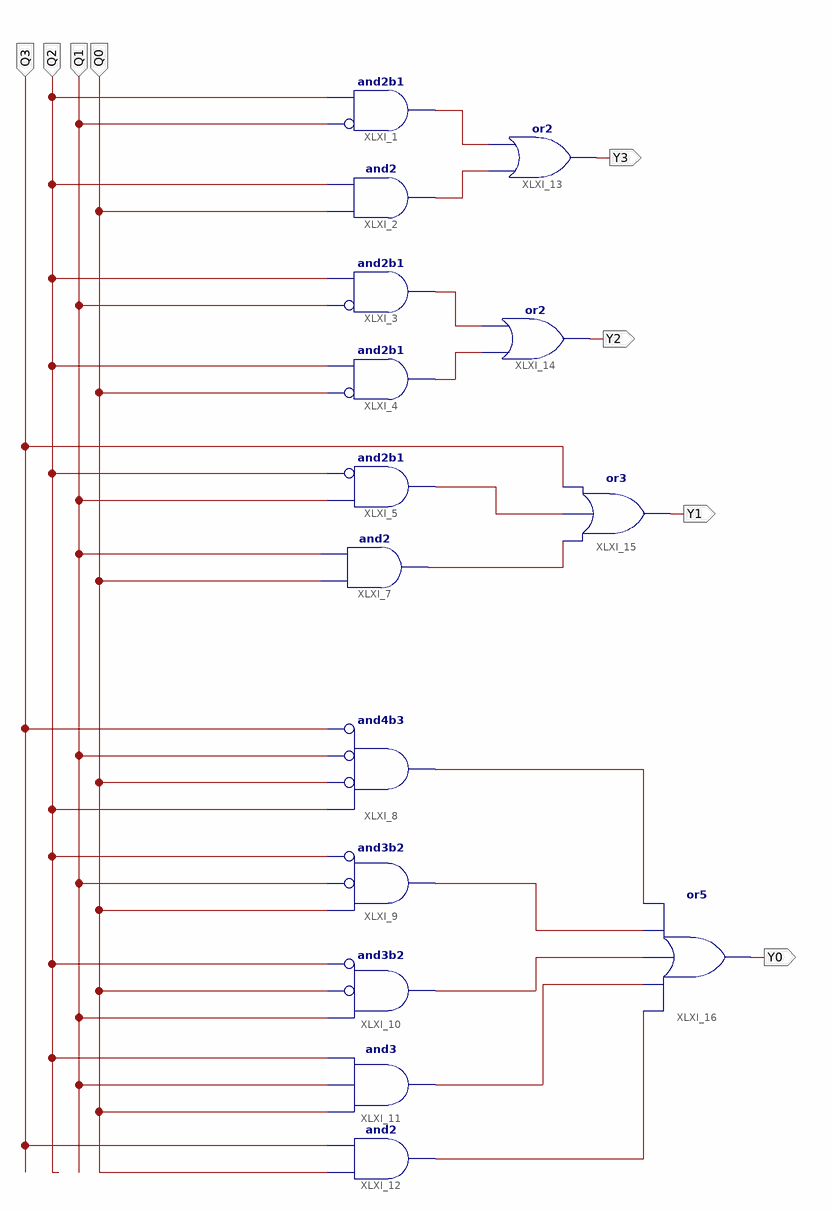
[diagram p0: schematic sheet 1]
// Xilinx ISE schematic sche3.sch (xc9500xl) as structural Verilog: 15 symbols, 8 ports
module sche3 (
  input  Q2,
  input  Q1,
  input  Q0,
  input  Q3,
  output Y3,
  output Y2,
  output Y1,
  output Y0
);

  wire XLXN_8, XLXN_9, XLXN_10, XLXN_11, XLXN_12, XLXN_13, XLXN_14, XLXN_15, XLXN_16, XLXN_17, XLXN_18;

  and XLXI_1 (XLXN_15, ~Q1, Q2);  // and2b1
  and XLXI_2 (XLXN_16, Q0, Q2);
  and XLXI_3 (XLXN_17, ~Q1, Q2);  // and2b1
  and XLXI_4 (XLXN_18, ~Q0, Q2);  // and2b1
  and XLXI_5 (XLXN_8, ~Q2, Q1);  // and2b1
  and XLXI_7 (XLXN_9, Q0, Q1);
  and XLXI_8 (XLXN_10, ~Q3, ~Q1, ~Q0, Q2);  // and4b3
  and XLXI_9 (XLXN_11, ~Q2, ~Q1, Q0);  // and3b2
  and XLXI_10 (XLXN_12, ~Q2, ~Q0, Q1);  // and3b2
  and XLXI_11 (XLXN_13, Q2, Q1, Q0);
  and XLXI_12 (XLXN_14, Q3, Q0);
  or XLXI_13 (Y3, XLXN_15, XLXN_16);
  or XLXI_14 (Y2, XLXN_17, XLXN_18);
  or XLXI_15 (Y1, Q3, XLXN_8, XLXN_9);
  or XLXI_16 (Y0, XLXN_10, XLXN_11, XLXN_12, XLXN_13, XLXN_14);
endmodule
